# Altium schematic sheet Sheet1.SchDoc
size A
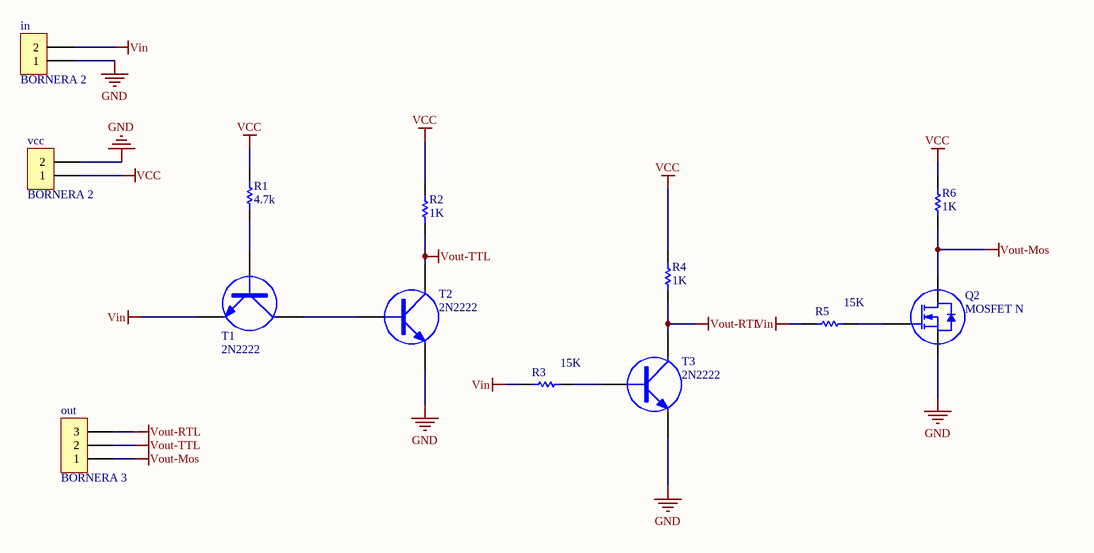
[diagram p0: Sheet1.SchDoc]

## Parts
in  BORNERA 2  [BORNERA2]
out  BORNERA 3  [BORNERA3]
Q2  MOSFET N  [TO92]
R1  4.7k  [0805]
R2  1K  [0805]
R3  15K  [0805]
R4  1K  [0805]
R5  15K  [0805]
R6  1K  [0805]
T1  2N2222  [TO92]
T2  2N2222  [TO92]
T3  2N2222  [TO92]
vcc  BORNERA 2  [BORNERA2]

## Nets
GND: in.1 Q2.3(S) T2.2(E) T3.2(E) vcc.2
VCC: R1.2 R2.2 R4.2 R6.2 vcc.1
Vin: in.2 R3.1 R5.1 T1.2(E)
Vout-Mos: out.1 Q2.2(D) R6.1
Vout-RTL: out.3 R4.1 T3.3(C)
Vout-TTL: out.2 R2.1 T2.3(C)
NetQ2_1: Q2.1(G) R5.2
NetR1_1: R1.1 T1.1(B)
NetR3_2: R3.2 T3.1(B)
NetT1_3: T1.3(C) T2.1(B)

## Library data of the parts
Q2 = MOSFET N: pin to pad: 2>3 3>2
R1-R6 = RES
T1-T3 = 2N2222: pin to pad: 2>3 3>2